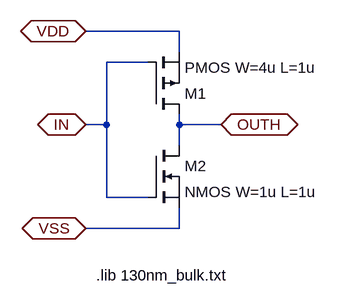
[diagram p0: schematic skewM_inverter.asc]
skewM_inverter.asc, the LTspice schematic file:
Version 4
SHEET 1 880 980
WIRE 320 -128 176 -128
WIRE 320 -96 320 -128
WIRE 272 -80 208 -80
WIRE 208 16 208 -80
WIRE 208 16 176 16
WIRE 320 16 320 0
WIRE 384 16 320 16
WIRE 320 48 320 16
WIRE 208 128 208 16
WIRE 272 128 208 128
WIRE 320 176 320 144
WIRE 320 176 176 176
FLAG 384 16 OUTH
IOPIN 384 16 BiDir
FLAG 176 -128 VDD
IOPIN 176 -128 BiDir
FLAG 176 16 IN
IOPIN 176 16 BiDir
FLAG 176 176 VSS
IOPIN 176 176 BiDir
SYMBOL pmos 272 0 M180
SYMATTR InstName M1
SYMATTR Value PMOS W=4u L=1u
SYMBOL nmos 272 48 R0
SYMATTR InstName M2
SYMATTR Value NMOS W=1u L=1u
TEXT 192 248 Left 2 !.lib 130nm_bulk.txt

The netlist it stands for:
* skewM_inverter.asc
M1 OUTH IN VDD VDD PMOS W=4u L=1u
M2 OUTH IN VSS VSS NMOS W=1u L=1u
.model NMOS NMOS
.model PMOS PMOS
.lib standard.mos
.lib 130nm_bulk.txt
.backanno
.end